# Altium schematic sheet PWM_CON_USB.SchDoc: PWM Motor Controller - USB
size A4; Author: T. Burns; DocumentNumber: 5; Revision: 3; SheetNumber: 5; SheetTotal: 5; DrawnBy: Thomas Burns; Organization: N/A; ProjectName: PWM Motor Controller
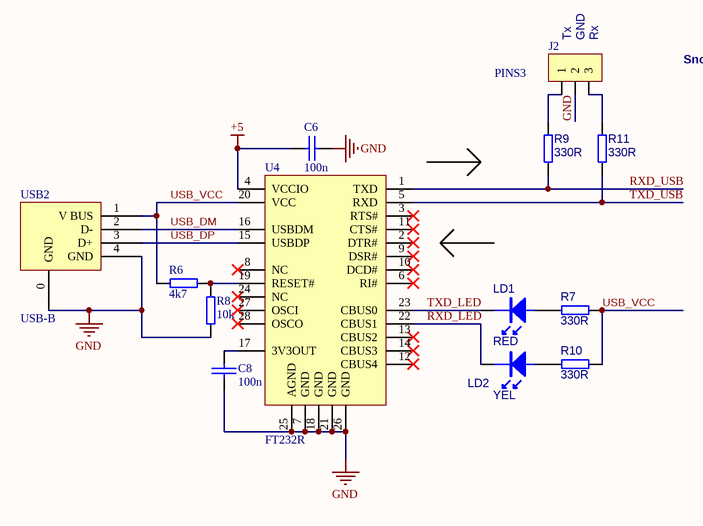
[diagram p0: PWM_CON_USB.SchDoc]

## Parts
C6  100n  [0603]
C8  100n  [0603]
J2  PINS3  [SIP3]
LD1  RED  [0805DIODE]
LD2  YEL  [0805DIODE]
R6  4k7  [0603]
R7  330R  [0603]
R8  10k  [0603]
R9  330R  [0603]
R10  330R  [0603]
R11  330R  [0603]
U4  FT232R  [ssop28]
USB2  USB-B  [USB_BV]

## Nets
+5: C6.2 U4.4(VCCIO)
GND: C6.1 C8.1 J2.2 R8.1 U4.7(GND) U4.18(GND) U4.21(GND) U4.25(AGND) U4.26(GND) USB2.0(GND) USB2.4(GND)
RXD_LED: LD2.K U4.22(CBUS1)
RXD_USB: R9.2 U4.1(TXD)
TXD_LED: LD1.K U4.23(CBUS0)
TXD_USB: R11.2 U4.5(RXD)
USB_DM: U4.16(USBDM) USB2.2(D-)
USB_DP: U4.15(USBDP) USB2.3(D+)
USB_VCC: R6.1 R7.1 R10.1 U4.20(VCC) USB2.1(V_BUS)
NetC8_2: C8.2 U4.17(3V3OUT)
NetJ2_1: J2.1 R9.1
NetJ2_3: J2.3 R11.1
NetLD1_A: LD1.A R7.2
NetLD2_A: LD2.A R10.2
NetR6_2: R6.2 R8.2 U4.19(RESET#)

Not connected (* = marked no-connect by the designer): U4 2(DTR#)* 3(RTS#)* 6(RI#)* 8(NC)* 9(DSR#)* 10(DCD#)* 11(CTS#)* 12(CBUS4)* 13(CBUS2)* 14(CBUS3)* 24(NC)* 27(OSCI)* 28(OSCO)*

## Notes on the sheet
- (near J2) Tx
- (near J2) GND
- (near J2) Rx
- Snoop
- Title
- Size:
- Date:
- A4
- Number:
- Time:
- Revision:
- Sheet
- of
- File:

## Library data of the parts
C6 C8 = CAP: PartNo: R8835; Supplier: Altronics
J2 = CON3: PartNo: P5430; Supplier: Altronics
LD1 = LED: PartNo: Y1107; Supplier: Altronics
LD2 = LED: PartNo: Y1116; Supplier: Altronics
R6 = RES8: 1% Resistor; PartNo: R1644; Supplier: Altronics
R7 R9-R11 = RES8: PartNo: R1560; Supplier: Element14
R8 = RES8: 1% Resistor; PartNo: R1668; Supplier: Altronics
U4 = FT232R: FTDI USB - USART; PartNo: 1146032RL; Supplier: Element14
USB2 = USB-B: PartNo: 1177884; Supplier: Element14